# Altium schematic sheet DIY_DAP_PCB_Audio.SchDoc: DIY_DAP_PCB_Audio
size A4; Revision: A; SheetNumber: 2; SheetTotal: 4
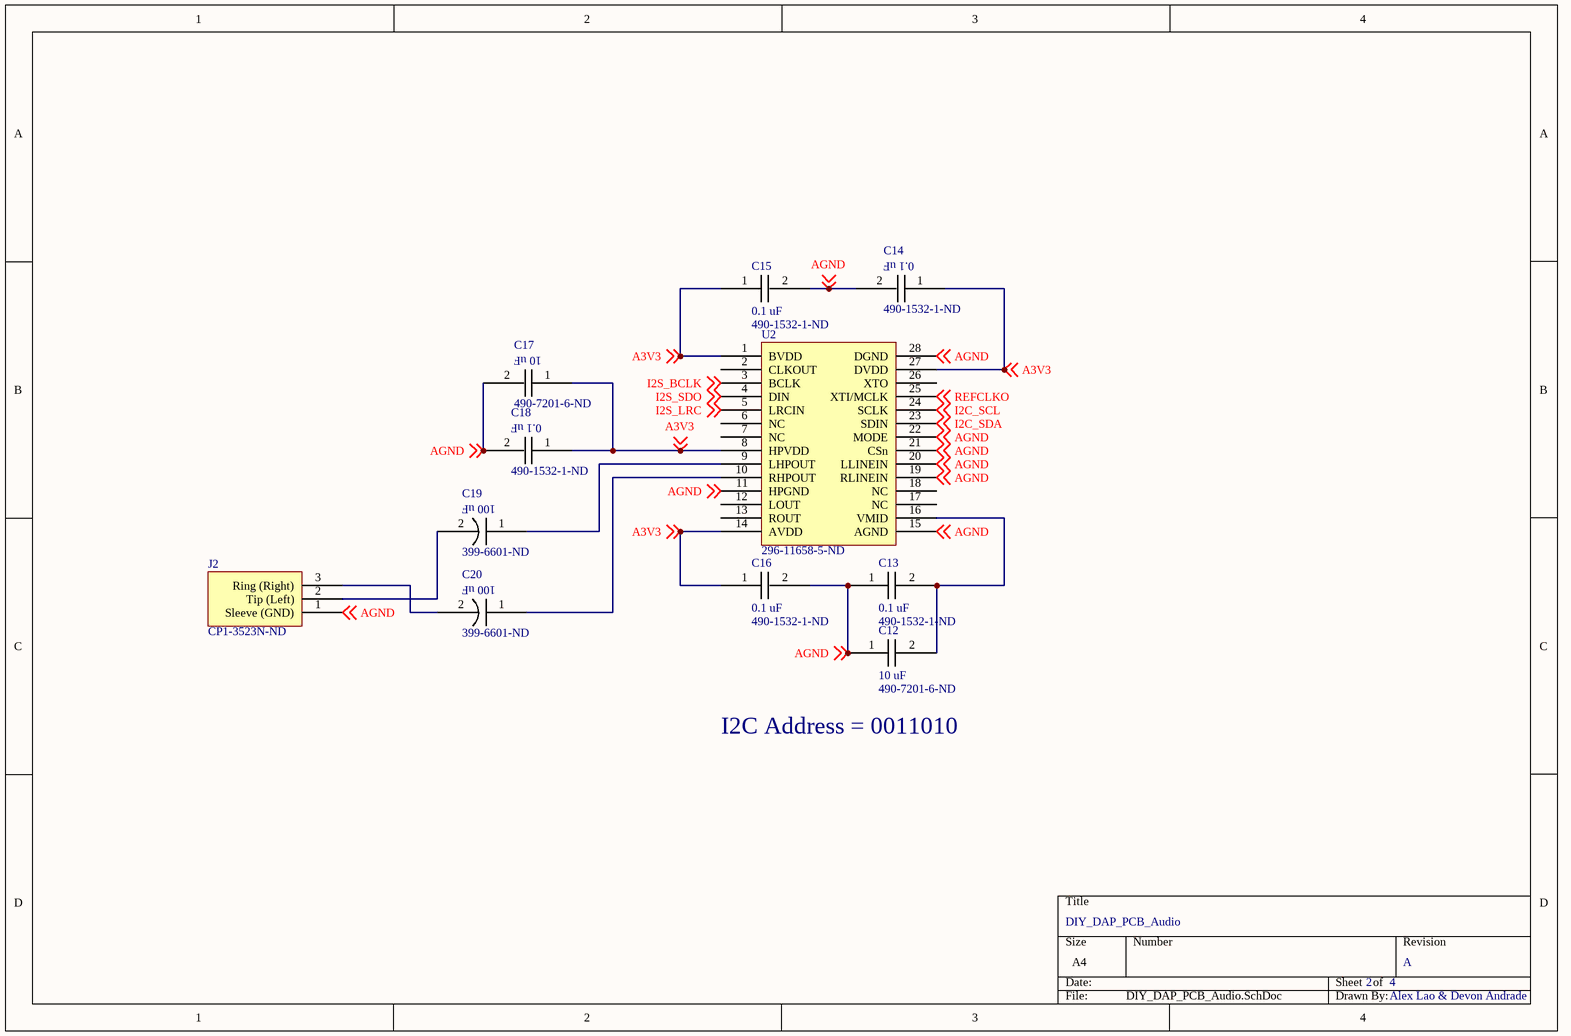
[diagram p0: DIY_DAP_PCB_Audio.SchDoc]

## Parts
C12  490-7201-6-ND  [0603]
C13  490-1532-1-ND  [0603]
C14  490-1532-1-ND  [0603]
C15  490-1532-1-ND  [0603]
C16  490-1532-1-ND  [0603]
C17  490-7201-6-ND  [0603]
C18  490-1532-1-ND  [0603]
C19  399-6601-ND  [399-6601-ND]
C20  399-6601-ND  [399-6601-ND]
J2  CP1-3523N-ND  [CP1-3523N-ND]
U2  296-11658-5-ND  [296-11658-5-ND]

## Nets
A3V3: C14.1 C15.1 C16.1 C17.1 C18.1 U2.1(BVDD) U2.8(HPVDD) U2.14(AVDD) U2.27(DVDD) ; off-sheet A3V3
AGND: C12.1 C13.1 C14.2 C15.2 C16.2 C17.2 C18.2 J2.1(Sleeve_(GND)) U2.11(HPGND) U2.15(AGND) U2.19(RLINEIN) U2.20(LLINEIN) U2.21(CSn) U2.22(MODE) U2.28(DGND) ; off-sheet AGND
I2C_SCL: U2.24(SCLK) ; off-sheet I2C_SCL
I2C_SDA: U2.23(SDIN) ; off-sheet I2C_SDA
I2S_BCLK: U2.3(BCLK) ; off-sheet I2S_BCLK
I2S_LRC: U2.5(LRCIN) ; off-sheet I2S_LRC
I2S_SDO: U2.4(DIN) ; off-sheet I2S_SDO
REFCLKO: U2.25(XTI/MCLK) ; off-sheet REFCLKO
NetC12_2: C12.2 C13.2 U2.16(VMID)
NetC19_1: C19.1 U2.9(LHPOUT)
NetC19_2: C19.2 J2.2(Tip_(Left))
NetC20_1: C20.1 U2.10(RHPOUT)
NetC20_2: C20.2 J2.3(Ring_(Right))

Not connected (* = marked no-connect by the designer): U2 2(CLKOUT) 6(NC) 7(NC) 12(LOUT) 13(ROUT) 17(NC) 18(NC) 26(XTO)

## Notes on the sheet
- I2C Address = 0011010
- Alex Lao & Devon Andrade
- (in symbol 399-6601-ND) 100 uF
- (in symbol 490-1532-1-ND) 0.1 uF
- (in symbol 490-7201-6-ND) 10 uF

## Library data of the parts
C12 C17 = 490-7201-6-ND: 0603 10 uF - 16V - Ceramic Capacitor; Supplier 1: Digi-Key
C13-C16 C18 = 490-1532-1-ND: 0603 0.1 uF - 16V - Ceramic Capacitor; Supplier 1: Digi-Key
C19 C20 = 399-6601-ND: 100 uF - 16V - Electrolytic Capacitor; Supplier 1: Digi-Key
J2 = CP1-3523N-ND: 3.5mm Audio Jack; Supplier 1: Digi-Key
U2 = 296-11658-5-ND: TLV320DAC23PW; Supplier 1: Digi-Key